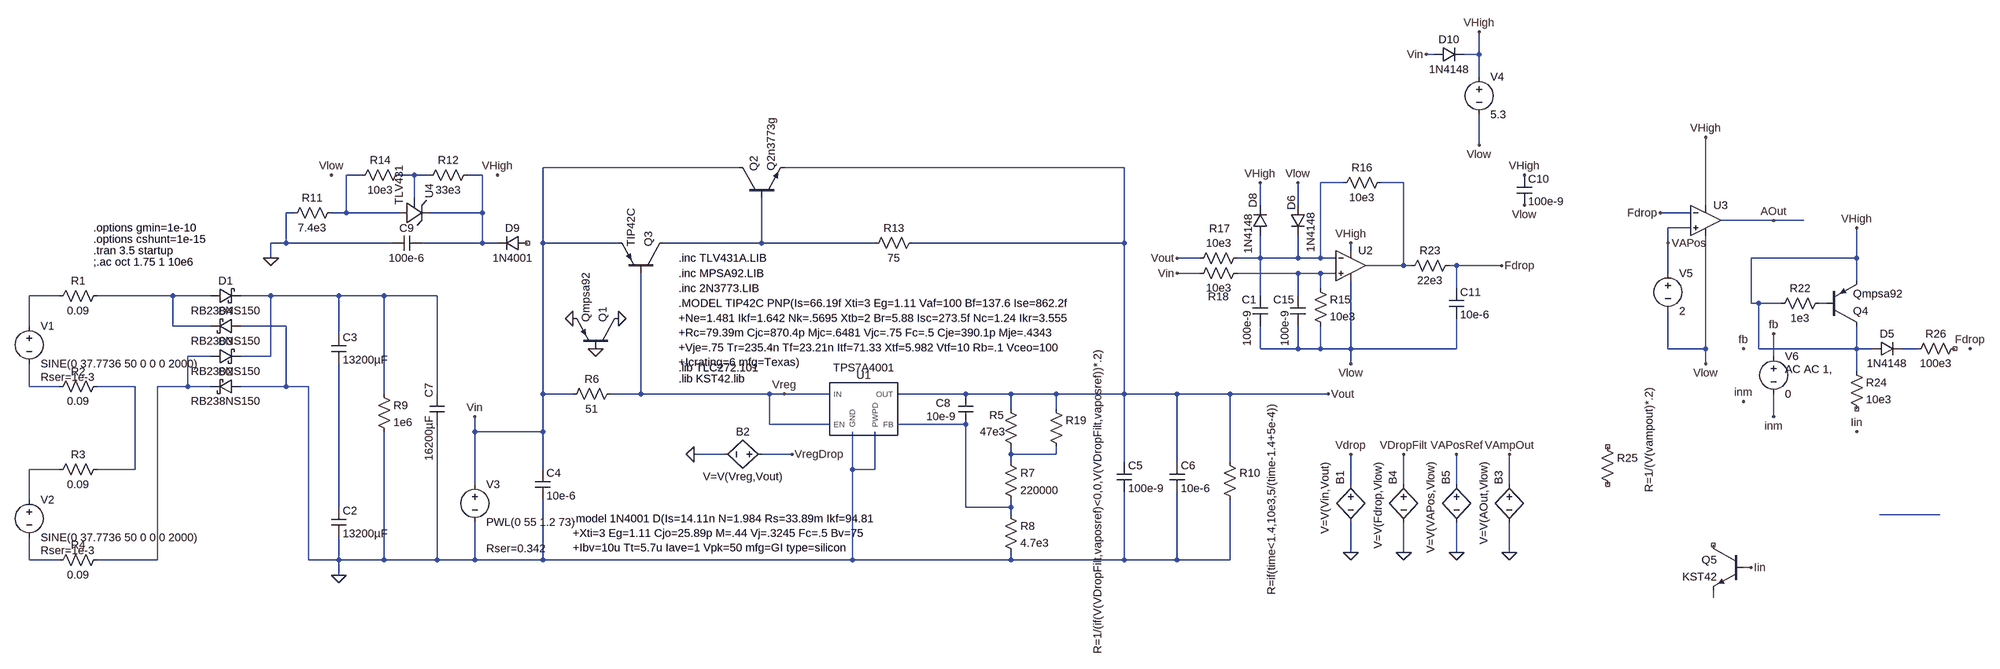
[diagram p0: schematic VClamp.asc]
VClamp.asc, the LTspice schematic file:
Version 4
SHEET 1 7124 1064
WIRE 3280 -528 3264 -528
WIRE 3376 -528 3376 -576
WIRE 3376 -528 3344 -528
WIRE 3376 -480 3376 -528
WIRE 3376 -336 3376 -400
WIRE 1808 -288 1392 -288
WIRE 2624 -288 1904 -288
WIRE 1008 -272 976 -272
WIRE 1120 -272 1088 -272
WIRE 1152 -272 1120 -272
WIRE 1264 -272 1232 -272
WIRE 3088 -256 3040 -256
WIRE 3216 -256 3168 -256
WIRE 1120 -224 1120 -272
WIRE 2912 -208 2912 -256
WIRE 2992 -208 2992 -256
WIRE 3856 -208 3856 -352
WIRE 864 -192 848 -192
WIRE 976 -192 976 -272
WIRE 976 -192 944 -192
WIRE 1088 -192 976 -192
WIRE 1264 -192 1264 -272
WIRE 1264 -192 1152 -192
WIRE 3824 -192 3760 -192
WIRE 4000 -176 3888 -176
WIRE 4064 -176 4000 -176
WIRE 3824 -160 3776 -160
WIRE 848 -128 848 -192
WIRE 848 -128 816 -128
WIRE 1072 -128 848 -128
WIRE 1264 -128 1264 -192
WIRE 1264 -128 1136 -128
WIRE 1296 -128 1264 -128
WIRE 1392 -128 1392 -288
WIRE 1552 -128 1392 -128
WIRE 1856 -128 1856 -224
WIRE 1856 -128 1648 -128
WIRE 2096 -128 1856 -128
WIRE 2624 -128 2624 -288
WIRE 2624 -128 2176 -128
WIRE 3776 -128 3776 -160
WIRE 3104 -112 3104 -128
WIRE 816 -96 816 -128
WIRE 2784 -96 2736 -96
WIRE 2912 -96 2912 -144
WIRE 2912 -96 2864 -96
WIRE 2992 -96 2992 -144
WIRE 2992 -96 2912 -96
WIRE 3040 -96 3040 -256
WIRE 3040 -96 2992 -96
WIRE 3072 -96 3040 -96
WIRE 4176 -96 4176 -160
WIRE 4176 -96 3952 -96
WIRE 3216 -80 3216 -256
WIRE 3216 -80 3136 -80
WIRE 3232 -80 3216 -80
WIRE 3328 -80 3312 -80
WIRE 3424 -80 3328 -80
WIRE 2784 -64 2736 -64
WIRE 2992 -64 2864 -64
WIRE 3040 -64 2992 -64
WIRE 3072 -64 3040 -64
WIRE 3776 -64 3776 -128
WIRE 4176 -48 4176 -96
WIRE 3040 -32 3040 -64
WIRE 3328 -32 3328 -80
WIRE 368 -16 304 -16
WIRE 608 -16 448 -16
WIRE 688 -16 608 -16
WIRE 816 -16 752 -16
WIRE 960 -16 816 -16
WIRE 1056 -16 960 -16
WIRE 1168 -16 1056 -16
WIRE 2912 -16 2912 -96
WIRE 2992 -16 2992 -64
WIRE 3952 0 3952 -96
WIRE 3968 0 3952 0
WIRE 4016 0 3968 0
WIRE 4112 0 4096 0
WIRE 304 48 304 -16
WIRE 608 48 608 -16
WIRE 688 48 608 48
WIRE 848 48 752 48
WIRE 960 64 960 -16
WIRE 2912 96 2912 48
WIRE 2992 96 2992 48
WIRE 2992 96 2912 96
WIRE 3040 96 3040 48
WIRE 3040 96 2992 96
WIRE 3104 96 3104 -48
WIRE 3104 96 3040 96
WIRE 3328 96 3328 32
WIRE 3328 96 3104 96
WIRE 3776 96 3776 16
WIRE 3856 96 3856 -144
WIRE 3856 96 3776 96
WIRE 3968 96 3968 0
WIRE 4176 96 4176 48
WIRE 4176 96 3968 96
WIRE 4208 96 4176 96
WIRE 4304 96 4272 96
WIRE 688 112 640 112
WIRE 816 112 816 -16
WIRE 816 112 752 112
WIRE 4000 112 4000 64
WIRE 3104 128 3104 96
WIRE 3856 128 3856 96
WIRE 4176 144 4176 96
WIRE 304 176 304 128
WIRE 368 176 304 176
WIRE 528 176 448 176
WIRE 640 176 640 112
WIRE 640 176 576 176
WIRE 688 176 640 176
WIRE 848 176 848 48
WIRE 848 176 752 176
WIRE 896 176 848 176
WIRE 1056 192 1056 -16
WIRE 1168 192 1168 -16
WIRE 1392 192 1392 -128
WIRE 1456 192 1392 192
WIRE 1600 192 1600 -64
WIRE 1600 192 1536 192
WIRE 1872 192 1600 192
WIRE 1904 192 1872 192
WIRE 2000 192 1904 192
WIRE 2288 192 2144 192
WIRE 2384 192 2288 192
WIRE 2480 192 2384 192
WIRE 2624 192 2624 -128
WIRE 2624 192 2480 192
WIRE 2736 192 2624 192
WIRE 2848 192 2736 192
WIRE 3056 192 2848 192
WIRE 2384 224 2384 192
WIRE 2480 224 2480 192
WIRE 4000 240 4000 192
WIRE 1872 256 1872 192
WIRE 2000 256 1872 256
WIRE 2288 256 2144 256
WIRE 1248 272 1248 240
WIRE 1392 272 1392 192
WIRE 1392 272 1248 272
WIRE 1776 320 1712 320
WIRE 1920 320 1856 320
WIRE 2384 320 2384 304
WIRE 2480 320 2480 304
WIRE 2480 320 2384 320
WIRE 2384 336 2384 320
WIRE 2624 336 2624 192
WIRE 2736 336 2736 192
WIRE 2848 336 2848 192
WIRE 368 352 304 352
WIRE 528 352 528 176
WIRE 528 352 448 352
WIRE 1392 352 1392 272
WIRE 2048 352 2048 272
WIRE 2096 352 2096 272
WIRE 2096 352 2048 352
WIRE 1248 384 1248 272
WIRE 3104 384 3104 320
WIRE 3216 384 3216 320
WIRE 3328 384 3328 320
WIRE 3440 384 3440 320
WIRE 304 416 304 352
WIRE 960 432 960 128
WIRE 2288 432 2288 256
WIRE 2384 432 2384 416
WIRE 2384 432 2288 432
WIRE 2384 448 2384 432
WIRE 4352 448 4224 448
WIRE 3104 528 3104 464
WIRE 3216 528 3216 464
WIRE 3328 528 3328 464
WIRE 3440 528 3440 464
WIRE 304 544 304 496
WIRE 368 544 304 544
WIRE 576 544 576 176
WIRE 576 544 448 544
WIRE 896 544 896 176
WIRE 960 544 960 496
WIRE 960 544 896 544
WIRE 1056 544 1056 272
WIRE 1056 544 960 544
WIRE 1168 544 1168 256
WIRE 1168 544 1056 544
WIRE 1248 544 1248 464
WIRE 1248 544 1168 544
WIRE 1392 544 1392 416
WIRE 1392 544 1248 544
WIRE 2048 544 2048 352
WIRE 2048 544 1392 544
WIRE 2384 544 2384 528
WIRE 2384 544 2048 544
WIRE 2624 544 2624 400
WIRE 2624 544 2384 544
WIRE 2736 544 2736 400
WIRE 2736 544 2624 544
WIRE 2848 544 2848 416
WIRE 2848 544 2736 544
WIRE 3952 560 3936 560
WIRE 960 576 960 544
WIRE 3872 624 3872 608
FLAG 960 576 0
FLAG 1248 240 Vin
FLAG 3056 192 Vout
FLAG 3104 528 0
FLAG 1904 192 Vreg
FLAG 1712 320 0
FLAG 3104 320 Vdrop
FLAG 1920 320 VregDrop
FLAG 2736 -64 Vin
FLAG 2736 -96 Vout
FLAG 816 -96 0
FLAG 1296 -272 VHigh
FLAG 944 -272 Vlow
FLAG 3104 128 Vlow
FLAG 3104 -128 VHigh
FLAG 3472 -272 VHigh
FLAG 3472 -208 Vlow
FLAG 3952 560 Iin
FLAG 1504 96 0
FLAG 1552 32 0
FLAG 1456 32 0
FLAG 2992 -256 Vlow
FLAG 2912 -256 VHigh
FLAG 3376 -576 VHigh
FLAG 3376 -336 Vlow
FLAG 3264 -528 Vin
FLAG 3856 -352 VHigh
FLAG 3856 128 Vlow
FLAG 3424 -80 Fdrop
FLAG 3760 -192 Fdrop
FLAG 4176 272 Iin
FLAG 4000 64 fb
FLAG 4000 240 inm
FLAG 3936 208 inm
FLAG 3936 96 fb
FLAG 4176 -160 VHigh
FLAG 4416 96 Fdrop
FLAG 3440 528 0
FLAG 3440 320 VAmpOut
FLAG 3216 528 0
FLAG 3216 320 VDropFilt
FLAG 3328 528 0
FLAG 3328 320 VAPosRef
FLAG 3776 -128 VAPos
FLAG 4000 -176 AOut
SYMBOL voltage 304 32 R0
WINDOW 123 0 0 Left 0
WINDOW 39 24 124 Left 2
SYMATTR SpiceLine Rser=1e-3
SYMATTR InstName V1
SYMATTR Value SINE(0 37.7736 50 0 0 0 2000)
SYMBOL schottky 688 0 R270
WINDOW 0 32 32 VTop 2
WINDOW 3 0 32 VBottom 2
SYMATTR InstName D1
SYMATTR Value RB238NS150
SYMATTR Description Diode
SYMATTR Type diode
SYMBOL schottky 752 160 R90
WINDOW 0 0 32 VBottom 2
WINDOW 3 32 32 VTop 2
SYMATTR InstName D2
SYMATTR Value RB238NS150
SYMATTR Description Diode
SYMATTR Type diode
SYMBOL schottky 688 128 R270
WINDOW 0 32 32 VTop 2
WINDOW 3 0 32 VBottom 2
SYMATTR InstName D3
SYMATTR Value RB238NS150
SYMATTR Description Diode
SYMATTR Type diode
SYMBOL schottky 752 32 R90
WINDOW 0 0 32 VBottom 2
WINDOW 3 32 32 VTop 2
SYMATTR InstName D4
SYMATTR Value RB238NS150
SYMATTR Description Diode
SYMATTR Type diode
SYMBOL res 464 -32 R90
WINDOW 0 0 56 VBottom 2
WINDOW 3 32 56 VTop 2
SYMATTR InstName R1
SYMATTR Value 0.09
SYMBOL res 464 160 R90
WINDOW 0 0 56 VBottom 2
WINDOW 3 32 56 VTop 2
SYMATTR InstName R2
SYMATTR Value 0.09
SYMBOL voltage 304 400 R0
WINDOW 123 0 0 Left 0
WINDOW 39 24 124 Left 2
SYMATTR SpiceLine Rser=1e-3
SYMATTR InstName V2
SYMATTR Value SINE(0 37.7736 50 0 0 0 2000)
SYMBOL res 464 336 R90
WINDOW 0 0 56 VBottom 2
WINDOW 3 32 56 VTop 2
SYMATTR InstName R3
SYMATTR Value 0.09
SYMBOL res 464 528 R90
WINDOW 0 0 56 VBottom 2
WINDOW 3 32 56 VTop 2
SYMATTR InstName R4
SYMATTR Value 0.09
SYMBOL cap 944 432 R0
SYMATTR InstName C2
SYMATTR Value 13200µF
SYMATTR SpiceLine V=50 Rser=0.03
SYMBOL cap 944 64 R0
SYMATTR InstName C3
SYMATTR Value 13200µF
SYMATTR SpiceLine V=50 Rser=0.03
SYMBOL cap 1376 352 R0
SYMATTR InstName C4
SYMATTR Value 10e-6
SYMATTR SpiceLine V=100
SYMBOL res 2368 320 R0
SYMATTR InstName R7
SYMATTR Value 220000
SYMBOL res 2368 432 R0
SYMATTR InstName R8
SYMATTR Value 4.7e3
SYMBOL cap 2608 336 R0
SYMATTR InstName C5
SYMATTR Value 100e-9
SYMBOL voltage 1248 368 R0
WINDOW 123 24 124 Left 2
WINDOW 39 24 152 Left 2
SYMATTR SpiceLine Rser=0.342
SYMATTR InstName V3
SYMATTR Value PWL(0 55 1.2 73)
SYMBOL res 1040 176 R0
SYMATTR InstName R9
SYMATTR Value 1e6
SYMBOL TPS7A4001 2064 224 R0
SYMATTR InstName U1
SYMBOL cap 2272 192 R0
WINDOW 0 -47 19 Left 2
WINDOW 3 -67 48 Left 2
SYMATTR InstName C8
SYMATTR Value 10e-9
SYMBOL res 1440 208 R270
WINDOW 0 32 56 VTop 2
WINDOW 3 0 56 VBottom 2
SYMATTR InstName R6
SYMATTR Value 51
SYMBOL pnp 1552 96 M270
SYMATTR InstName Q1
SYMATTR Value Qmpsa92
SYMBOL res 2080 -112 R270
WINDOW 0 32 56 VTop 2
WINDOW 3 0 56 VBottom 2
SYMATTR InstName R13
SYMATTR Value 75
SYMBOL npn 1808 -224 R270
SYMATTR InstName Q2
SYMATTR Value Q2n3773g
SYMBOL bv 3104 368 R0
WINDOW 0 -22 -13 VRight 2
WINDOW 3 -54 -32 VRight 2
SYMATTR InstName B1
SYMATTR Value V=V(Vin,Vout)
SYMBOL bv 1872 320 R90
WINDOW 0 -32 56 VBottom 2
WINDOW 3 32 56 VTop 2
SYMATTR InstName B2
SYMATTR Value V=V(Vreg,Vout)
SYMBOL res 2832 320 R0
WINDOW 3 104 -110 VRight 2
SYMATTR Value R=if(time<1.4,10e3,5/(time-1.4+5e-4))
SYMATTR InstName R10
SYMBOL pnp 1648 -64 M270
SYMATTR InstName Q3
SYMATTR Value TIP42C
SYMBOL cap 1152 192 R0
WINDOW 0 -1 -22 VRight 2
WINDOW 3 -1 46 VRight 2
SYMATTR InstName C7
SYMATTR Value 16200µF
SYMATTR SpiceLine V=80 Rser=0.016
SYMBOL cap 2720 336 R0
SYMATTR InstName C6
SYMATTR Value 10e-6
SYMBOL res 2368 208 R0
WINDOW 0 -30 29 Left 2
WINDOW 3 -50 64 Left 2
SYMATTR InstName R5
SYMATTR Value 47e3
SYMBOL res 960 -208 R90
WINDOW 0 0 56 VBottom 2
WINDOW 3 32 56 VTop 2
SYMATTR InstName R11
SYMATTR Value 7.4e3
SYMBOL res 1248 -288 R90
WINDOW 0 0 56 VBottom 2
WINDOW 3 32 56 VTop 2
SYMATTR InstName R12
SYMATTR Value 33e3
SYMBOL res 1104 -288 R90
WINDOW 0 0 56 VBottom 2
WINDOW 3 32 56 VTop 2
SYMATTR InstName R14
SYMATTR Value 10e3
SYMBOL res 3024 -48 R0
SYMATTR InstName R15
SYMATTR Value 10e3
SYMBOL res 3184 -272 R90
WINDOW 0 0 56 VBottom 2
WINDOW 3 32 56 VTop 2
SYMATTR InstName R16
SYMATTR Value 10e3
SYMBOL res 2880 -112 R90
WINDOW 0 -31 54 VBottom 2
WINDOW 3 -31 56 VTop 2
SYMATTR InstName R17
SYMATTR Value 10e3
SYMBOL res 2880 -80 R90
WINDOW 0 81 56 VBottom 2
WINDOW 3 32 56 VTop 2
SYMATTR InstName R18
SYMATTR Value 10e3
SYMBOL diode 1360 -144 R90
WINDOW 0 0 32 VBottom 2
WINDOW 3 32 32 VTop 2
SYMATTR InstName D9
SYMATTR Value 1N4001
SYMBOL cap 1136 -144 R90
WINDOW 0 0 32 VBottom 2
WINDOW 3 32 32 VTop 2
SYMATTR InstName C9
SYMATTR Value 100e-6
SYMBOL cap 3456 -272 R0
SYMATTR InstName C10
SYMATTR Value 100e-9
SYMBOL res 3328 -96 R90
WINDOW 0 0 56 VBottom 2
WINDOW 3 32 56 VTop 2
SYMATTR InstName R23
SYMATTR Value 22e3
SYMBOL cap 3312 -32 R0
SYMATTR InstName C11
SYMATTR Value 10e-6
SYMATTR SpiceLine IC=0.8
SYMBOL TLV431A 1120 -192 M270
SYMATTR InstName U4
SYMBOL OpAmps\\UniversalOpamp2 3104 -80 R0
SYMATTR InstName U2
SYMATTR Value2 Avol=1Meg GBW=1g Slew=10Meg
SYMBOL diode 2976 -208 R0
WINDOW 0 3 -20 VRight 2
WINDOW 3 44 15 VRight 2
SYMATTR InstName D6
SYMATTR Value 1N4148
SYMBOL diode 2928 -144 R180
WINDOW 0 31 58 VRight 2
WINDOW 3 41 -39 VRight 2
SYMATTR InstName D8
SYMATTR Value 1N4148
SYMBOL voltage 3376 -496 R0
WINDOW 123 0 0 Left 0
WINDOW 39 0 0 Left 0
SYMATTR InstName V4
SYMATTR Value 5.3
SYMBOL diode 3280 -512 R270
WINDOW 0 32 32 VTop 2
WINDOW 3 0 32 VBottom 2
SYMATTR InstName D10
SYMATTR Value 1N4148
SYMBOL voltage 3776 -80 R0
WINDOW 123 0 0 Left 0
WINDOW 39 0 0 Left 0
SYMATTR InstName V5
SYMATTR Value 2
SYMBOL pnp 4112 48 M180
SYMATTR InstName Q4
SYMATTR Value Qmpsa92
SYMBOL res 4112 -16 R90
WINDOW 0 0 56 VBottom 2
WINDOW 3 32 56 VTop 2
SYMATTR InstName R22
SYMATTR Value 1e3
SYMBOL OpAmps\\UniversalOpamp2 3856 -176 R0
SYMATTR InstName U3
SYMATTR Value2 Avol=1Meg GBW=1g Slew=10Meg
SYMBOL res 4160 128 R0
SYMATTR InstName R24
SYMATTR Value 10e3
SYMBOL npn 3936 512 M0
SYMATTR InstName Q5
SYMATTR Value KST42
SYMBOL cap 3008 48 R180
WINDOW 0 24 56 Left 2
WINDOW 3 43 -43 VRight 2
SYMATTR InstName C15
SYMATTR Value 100e-9
SYMBOL voltage 4000 96 R0
WINDOW 123 24 44 Left 2
WINDOW 39 0 0 Left 0
SYMATTR Value2 AC AC 1,
SYMATTR InstName V6
SYMATTR Value 0
SYMBOL cap 2928 48 R180
WINDOW 0 24 56 Left 2
WINDOW 3 43 -43 VRight 2
SYMATTR InstName C1
SYMATTR Value 100e-9
SYMBOL res 4400 80 R90
WINDOW 0 0 56 VBottom 2
WINDOW 3 32 56 VTop 2
SYMATTR InstName R26
SYMATTR Value 100e3
SYMBOL diode 4208 112 R270
WINDOW 0 32 32 VTop 2
WINDOW 3 0 32 VBottom 2
SYMATTR InstName D5
SYMATTR Value 1N4148
SYMBOL res 3632 288 R0
WINDOW 3 104 -110 VRight 2
SYMATTR Value R=1/(V(vampout)*.2)
SYMATTR InstName R25
SYMBOL bv 3440 368 R0
WINDOW 0 -22 -13 VRight 2
WINDOW 3 -54 -32 VRight 2
SYMATTR InstName B3
SYMATTR Value V=V(AOut,Vlow)
SYMBOL bv 3216 368 R0
WINDOW 0 -22 -13 VRight 2
WINDOW 3 -54 -32 VRight 2
SYMATTR InstName B4
SYMATTR Value V=V(Fdrop,Vlow)
SYMBOL bv 3328 368 R0
WINDOW 0 -22 -13 VRight 2
WINDOW 3 -54 -32 VRight 2
SYMATTR InstName B5
SYMATTR Value V=V(VAPos,Vlow)
SYMBOL res 2464 208 R0
WINDOW 3 104 -110 VRight 2
SYMATTR Value R=1/(if(V(VDropFilt,vaposref)<0,0,V(VDropFilt,vaposref))*.2)
SYMATTR InstName R19
TEXT 440 -112 Left 2 !.tran 3.5 startup
TEXT 440 -136 Left 2 !.options cshunt=1e-15
TEXT 1680 0 Left 2 !.MODEL TIP42C PNP(Is=66.19f Xti=3 Eg=1.11 Vaf=100 Bf=137.6 Ise=862.2f \n+Ne=1.481 Ikf=1.642 Nk=.5695 Xtb=2 Br=5.88 Isc=273.5f Nc=1.24 Ikr=3.555 \n+Rc=79.39m Cjc=870.4p Mjc=.6481 Vjc=.75 Fc=.5 Cje=390.1p Mje=.4343 \n+Vje=.75 Tr=235.4n Tf=23.21n Itf=71.33 Xtf=5.982 Vtf=10 Rb=.1 Vceo=100 \n+Icrating=6 mfg=Texas)
TEXT 1680 -32 Left 2 !.inc 2N3773.LIB
TEXT 1680 -64 Left 2 !.inc MPSA92.LIB
TEXT 1456 456 Left 2 !.model 1N4001 D(Is=14.11n N=1.984 Rs=33.89m Ikf=94.81\n+Xti=3 Eg=1.11 Cjo=25.89p M=.44 Vj=.3245 Fc=.5 Bv=75\n+Ibv=10u Tt=5.7u Iave=1 Vpk=50 mfg=GI type=silicon
TEXT 1680 -96 Left 2 !.inc TLV431A.LIB
TEXT 1680 136 Left 2 !.lib TLC272.101
TEXT 440 -160 Left 2 !.options gmin=1e-10
TEXT 1680 160 Left 2 !.lib KST42.lib
TEXT 440 -88 Left 2 !;.ac oct 1.75 1 10e6

The netlist it stands for:
* VClamp.asc
V1 N008 N014 SINE(0 37.7736 50 0 0 0 2000) Rser=1e-3
D1 N009 N010 RB238NS150
D2 0 N013 RB238NS150
D3 N013 N010 RB238NS150
D4 0 N009 RB238NS150
R1 N009 N008 0.09
R2 N015 N014 0.09
V2 N018 N021 SINE(0 37.7736 50 0 0 0 2000) Rser=1e-3
R3 N015 N018 0.09
R4 N013 N021 0.09
C2 N019 0 13200µF V=50 Rser=0.03
C3 N010 N019 13200µF V=50 Rser=0.03
C4 Vin 0 10e-6 V=100
R7 N017 N016 220000
R8 N016 0 4.7e3
C5 Vout 0 100e-9
V3 Vin 0 PWL(0 55 1.2 73) Rser=0.342
R9 N010 0 1e6
XU1 Vout 0 Vreg Vreg N016 0 TPS7A4001  ; pins OUT GND IN EN FB PWPD
C8 Vout N016 10e-9
R6 Vin Vreg 51
Q1 0 0 0 0 Qmpsa92
R13 N006 Vout 75
Q2 Vin N006 Vout 0 Q2n3773g
B1 Vdrop 0 V=V(Vin,Vout)
B2 VregDrop 0 V=V(Vreg,Vout)
R10 Vout 0 R=if(time<1.4,10e3,5/(time-1.4+5e-4))
Q3 N006 Vreg Vin 0 TIP42C
C7 N010 0 16200µF V=80 Rser=0.016
C6 Vout 0 10e-6
R5 Vout N017 47e3
R11 N001 0 7.4e3
R12 N003 N002 33e3
R14 N002 N001 10e3
R15 N007 Vlow 10e3
R16 N005 N004 10e3
R17 N004 Vout 10e3
R18 N007 Vin 10e3
D9 NC_01 N003 1N4001
C9 N003 0 100e-6
C10 VHigh Vlow 100e-9
R23 Fdrop N005 22e3
C11 Fdrop Vlow 10e-6 IC=0.8
XU4 N003 N001 N002 TLV431  ; pins K A REF
XU2 N007 N004 VHigh Vlow N005 level.2 Avol=1Meg GBW=1g Slew=10Meg ilimit=25m rail=0 Vos=0 phimargin=45 en=0 enk=0 in=0 ink=0 Rin=500Meg  ; pins IN+ IN- V+ V- OUT
D6 Vlow N004 1N4148
D8 N004 VHigh 1N4148
V4 VHigh Vlow 5.3
D10 Vin VHigh 1N4148
V5 VAPos Vlow 2
Q4 VHigh N011 VHigh 0 Qmpsa92
R22 N011 VHigh 1e3
XU3 VAPos Fdrop VHigh Vlow AOut level.2 Avol=1Meg GBW=1g Slew=10Meg ilimit=25m rail=0 Vos=0 phimargin=45 en=0 enk=0 in=0 ink=0 Rin=500Meg  ; pins IN+ IN- V+ V- OUT
R24 VHigh NC_02 10e3
Q5 NC_03 Iin N022 0 KST42
C15 Vlow N007 100e-9
V6 fb inm 0 AC AC 1,
C1 Vlow N004 100e-9
R26 NC_04 N012 100e3
D5 VHigh N012 1N4148
R25 NC_05 NC_06 R=1/(V(vampout)*.2)
B3 VAmpOut 0 V=V(AOut,Vlow)
B4 VDropFilt 0 V=V(Fdrop,Vlow)
B5 VAPosRef 0 V=V(VAPos,Vlow)
R19 Vout N017 R=1/(if(V(VDropFilt,vaposref)<0,0,V(VDropFilt,vaposref))*.2)
.model D D
.lib standard.dio
.model NPN NPN
.model PNP PNP
.lib standard.bjt
.tran 3.5 startup
.options cshunt=1e-15
.MODEL TIP42C PNP(Is=66.19f Xti=3 Eg=1.11 Vaf=100 Bf=137.6 Ise=862.2f
+Ne=1.481 Ikf=1.642 Nk=.5695 Xtb=2 Br=5.88 Isc=273.5f Nc=1.24 Ikr=3.555
+Rc=79.39m Cjc=870.4p Mjc=.6481 Vjc=.75 Fc=.5 Cje=390.1p Mje=.4343
+Vje=.75 Tr=235.4n Tf=23.21n Itf=71.33 Xtf=5.982 Vtf=10 Rb=.1 Vceo=100
+Icrating=6 mfg=Texas)
.inc 2N3773.LIB
.inc MPSA92.LIB
.model 1N4001 D(Is=14.11n N=1.984 Rs=33.89m Ikf=94.81
+Xti=3 Eg=1.11 Cjo=25.89p M=.44 Vj=.3245 Fc=.5 Bv=75
+Ibv=10u Tt=5.7u Iave=1 Vpk=50 mfg=GI type=silicon
.inc TLV431A.LIB
.lib TLC272.101
.options gmin=1e-10
.lib KST42.lib
;.ac oct 1.75 1 10e6
.lib TPS7A4001.LIB
.lib UniversalOpamps2.sub
.backanno
.end